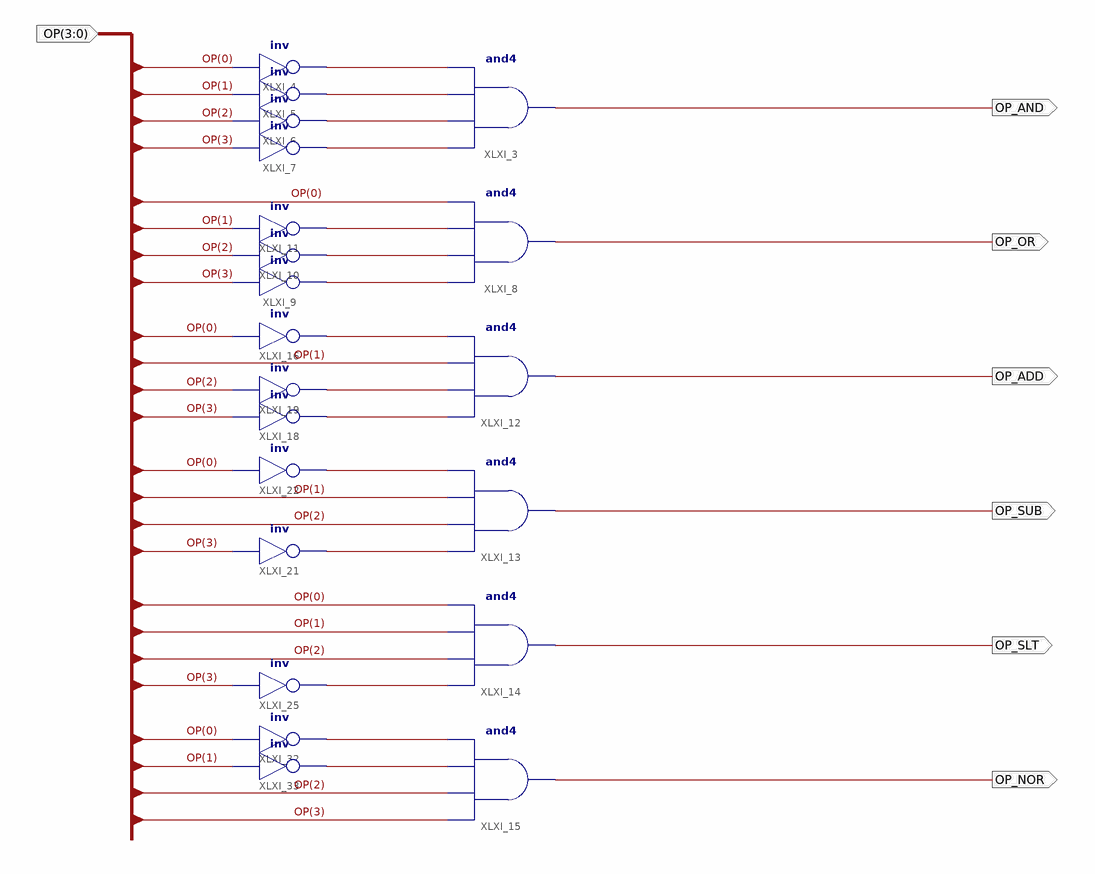
[diagram p0: schematic sheet 1]
// Xilinx ISE schematic op_decoder.sch (spartan3e) as structural Verilog: 21 symbols, 7 ports
module op_decoder (
  input  [3:0] OP,
  output OP_AND,
  output OP_OR,
  output OP_ADD,
  output OP_SUB,
  output OP_SLT,
  output OP_NOR
);

  wire XLXN_3, XLXN_4, XLXN_5, XLXN_6, XLXN_7, XLXN_8, XLXN_9, XLXN_15, XLXN_16, XLXN_17, XLXN_22, XLXN_23,
       XLXN_24, XLXN_39, XLXN_40;

  and XLXI_3 (OP_AND, XLXN_6, XLXN_5, XLXN_4, XLXN_3);
  not XLXI_4 (XLXN_3, OP[0]);
  not XLXI_5 (XLXN_4, OP[1]);
  not XLXI_6 (XLXN_5, OP[2]);
  not XLXI_7 (XLXN_6, OP[3]);
  and XLXI_8 (OP_OR, XLXN_7, XLXN_8, XLXN_9, OP[0]);
  not XLXI_9 (XLXN_7, OP[3]);
  not XLXI_10 (XLXN_8, OP[2]);
  not XLXI_11 (XLXN_9, OP[1]);
  and XLXI_12 (OP_ADD, XLXN_17, XLXN_16, OP[1], XLXN_15);
  and XLXI_13 (OP_SUB, XLXN_23, OP[2], OP[1], XLXN_22);
  and XLXI_14 (OP_SLT, XLXN_24, OP[2], OP[1], OP[0]);
  and XLXI_15 (OP_NOR, OP[3], OP[2], XLXN_40, XLXN_39);
  not XLXI_16 (XLXN_15, OP[0]);
  not XLXI_18 (XLXN_17, OP[3]);
  not XLXI_19 (XLXN_16, OP[2]);
  not XLXI_21 (XLXN_23, OP[3]);
  not XLXI_22 (XLXN_22, OP[0]);
  not XLXI_25 (XLXN_24, OP[3]);
  not XLXI_32 (XLXN_39, OP[0]);
  not XLXI_33 (XLXN_40, OP[1]);
endmodule
